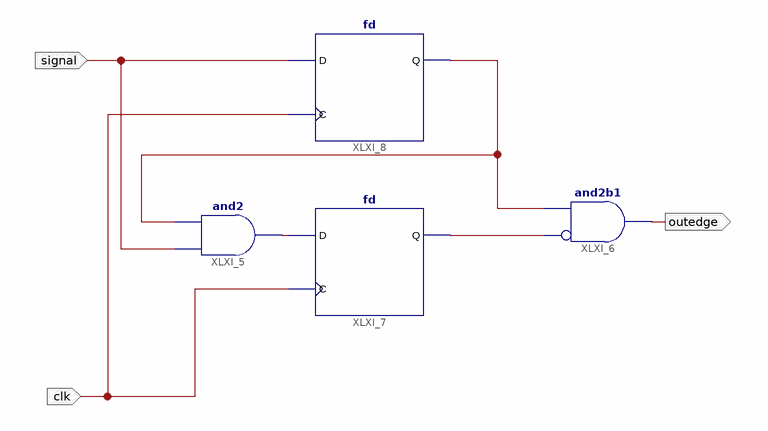
[diagram p0: schematic sheet 1]
// Xilinx ISE schematic rising_edge_detector_sm.sch (spartan3e) as structural Verilog: 4 symbols, 3 ports
module rising_edge_detector_sm (
  input  clk,
  input  signal,
  output outedge
);

  wire XLXN_3, XLXN_6, XLXN_15;

  and XLXI_5 (XLXN_3, signal, XLXN_15);
  and XLXI_6 (outedge, ~XLXN_6, XLXN_15);  // and2b1
  fd XLXI_7 (.C(clk), .D(XLXN_3), .Q(XLXN_6));
  fd XLXI_8 (.C(clk), .D(signal), .Q(XLXN_15));
endmodule
